# Altium schematic sheet LiPo_fuel_guage.SchDoc
size A
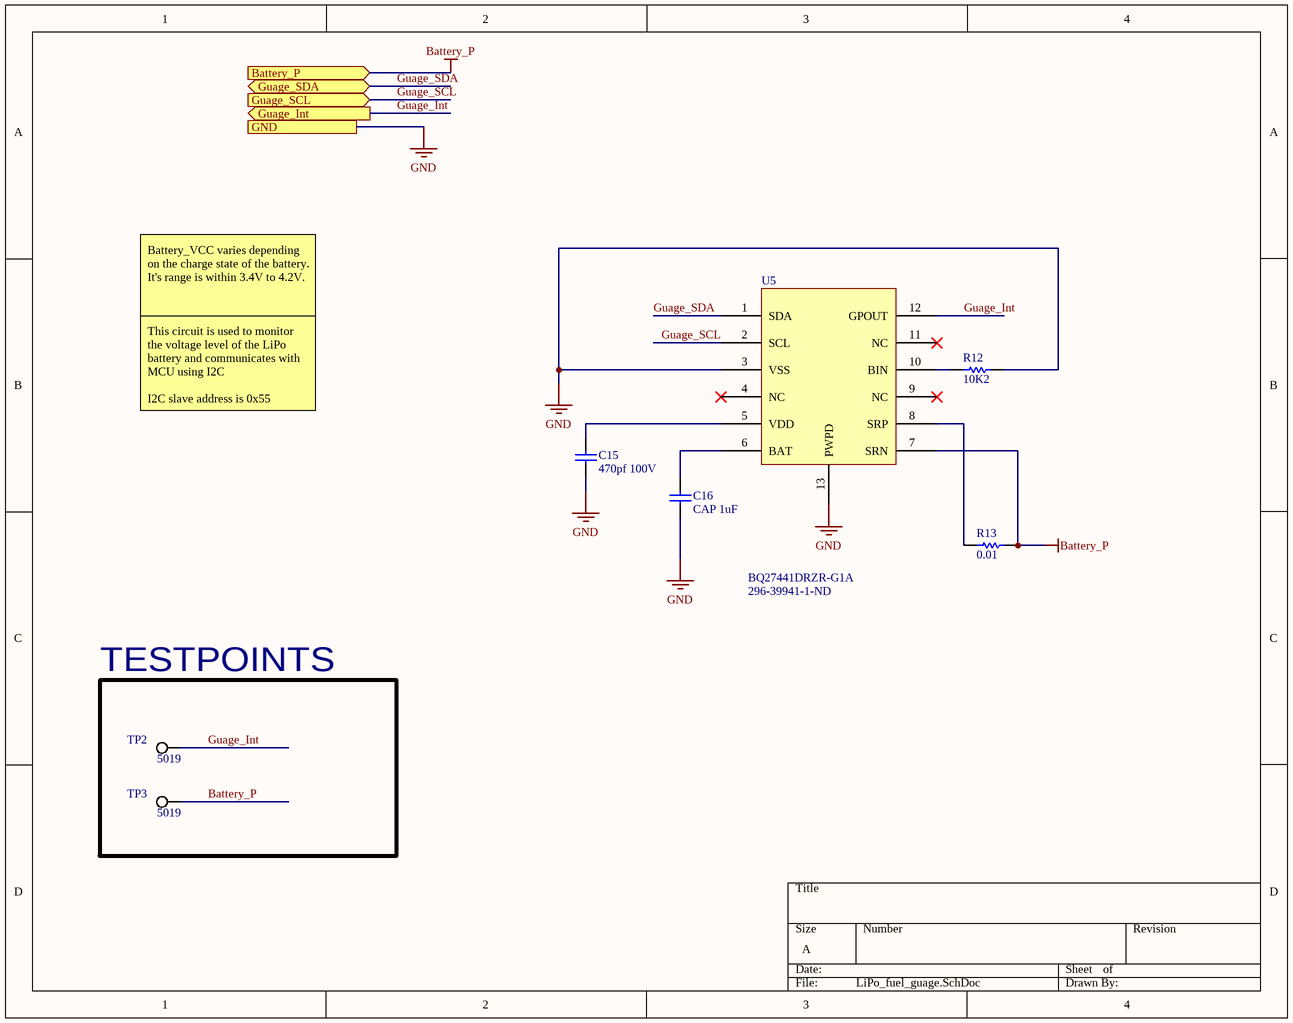
[diagram p0: LiPo_fuel_guage.SchDoc]

## Parts
C15  470pf 100V  [CAPC2013X70X45LL10T25]
C16  CAP 1uF  [CAPC0805(2012)100_L]
R12  10K2  [RESC0805(2012)_L]
R13  0.01  [RESC3216X70X50LL05T20]
TP2  5019  [KSTN-5019_V]
TP3  5019  [KSTN-5019_V]
U5  BQ27441DRZR-G1A  Supplier Part Number 1: 296-39941-1-ND  [*SON40P400X250X100-13N]

## Blocks framed on the sheet
TESTPOINTS: TP2 TP3

## Ports
Battery_P (in), GND, Guage_Int (out), Guage_SCL (in), Guage_SDA (bidir)

## Nets
Battery_P: R13.2 TP3.1 U5.7(SRN) ; port Battery_P
GND: C15.1 C16.1 R12.1 U5.3(VSS) U5.13(PWPD) ; port GND
Guage_Int: TP2.1 U5.12(GPOUT) ; port Guage_Int
Guage_SCL: U5.2(SCL) ; port Guage_SCL
Guage_SDA: U5.1(SDA) ; port Guage_SDA
NetC15_2: C15.2 U5.5(VDD)
NetC16_2: C16.2 U5.6(BAT)
NetR12_2: R12.2 U5.10(BIN)
NetR13_1: R13.1 U5.8(SRP)

Not connected (* = marked no-connect by the designer): U5 4(NC)* 9(NC)* 11(NC)*

## Notes on the sheet
- Battery_VCC varies depending on the charge state of the battery. It's range is within 3.4V to 4.2V.
- This circuit is used to monitor the voltage level of the LiPo battery and communicates with MCU using I2C
  I2C slave address is 0x55

## Library data of the parts
C15 = CMP-2007-00930-1: Manufacturer: Murata; Part Number: GRM2165C2A471JA01D
C16 = CMP-1036-04749-1: CAP 1uF 16V ±20% 0805 (2012 Metric) Thickness 1mm SMD; Case-EIA: 0805; Case-Metric: 2012; Tolerance: Â±20%; Value: 1uF; Rated Voltage: 16 V; Max Thickness: 1 mm; Technology: SMT
R12 = CMP-1013-00624-1: 10K2 0.125W 1% 0805 (2012 Metric)  SMD; Case-Metric: 2012; Case-EIA: 0805; Value: 10200.00 Ohm; Technology: SMT; Tolerance: 1 %; Power: 0.125 W
R13 = CMP-2003-00764-1: Part Number: ERJ8BWFR010V; Manufacturer: Panasonic
TP2 TP3 = CMP-1672-00008-1: Test Point, 1 Position SMD, RoHS, Tape and Reel; ComponentLink1Description: Manufacturer URL; Package Quantity: 1000; DatasheetVersion: 03/2014; Packaging: Tape and Reel; ComponentLink2URL: http://www.keyelco.com/product-pdf.cfm?p=1357; ComponentLink1URL: http://www.keyelco.com/; Mount: Surface Mount; Contact Plating: Silver; PackageDescription: 1-Pin Surface Mount Device, Body 3.81 x 2.03 mm; Pins: 1; RoHSCompliant: True; Mounting Technology: Surface Mount; ComponentLink2Description: Datasheet; PackageReference: 5019
U5 = BQ27441DRZR-G1A: Manufacturer: Texas Instruments; Number of Cells: 1; Interface: I2C; Capacity: 8000mAh; Output Voltage: 600mV; Output Current: 500uA; Operating Supply Voltage: 4.5V; Supplier 1: Digi-Key; Manufacturer Part Number: BQ27441DRZR-G1A; RoHS: Yes; Stock 1: 20268; Pricing 1: 1 = 2.62000, 10 = 2.35300, 100 = 1.89110, 500 = 1.55376, 1000 = 1.28740 (USD); Mount: Surface Mount; Case/Package: QFN; Number of Pins: 12; Contact Plating: Gold; Min Operating Temperature: -40°C; Max Operating Temperature: 85°C; Package Quantity: 3000; Packaging: Tape and Reel; Lead Free: Lead Free